# EAGLE schematic DaviShematic (EAGLE 9.6.2)
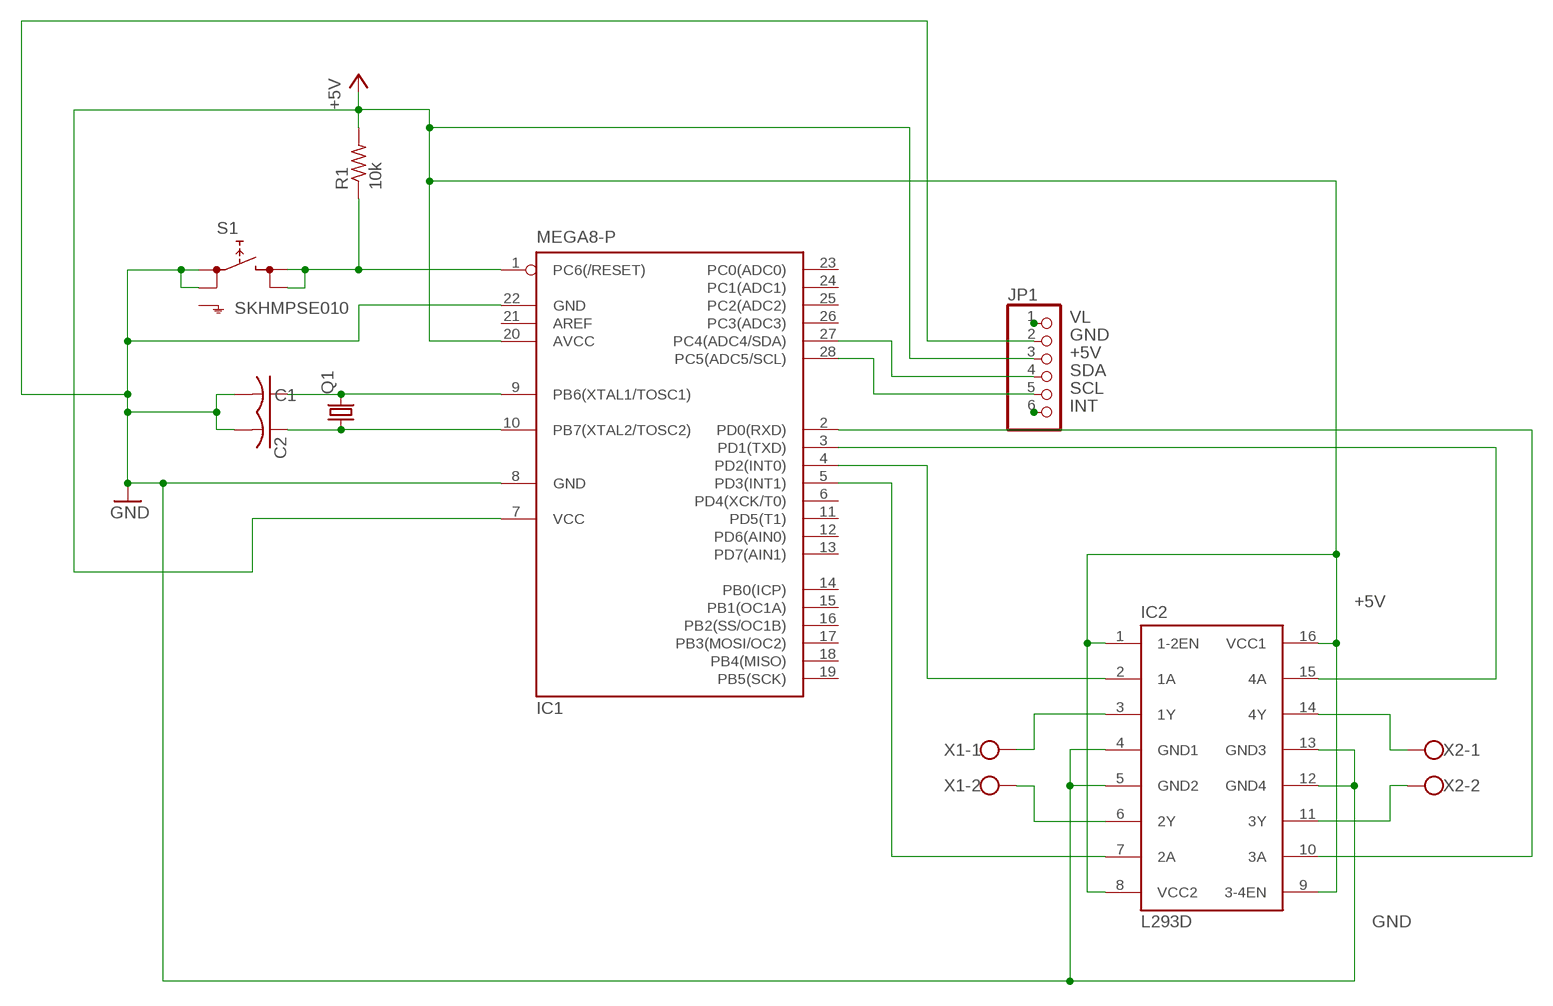
[diagram p0: schematic, sheet 1]

## Parts
C1  C-US025-024X044  [C025-024X044]
C2  C-US025-024X044  [C025-024X044]
IC1  MEGA8-P  [DIL28-3]
IC2  L293D  [DIL16]
JP1  PINHD-1X6  [1X06]
Q1  CRYSTALHC49U-V  [HC49U-V]
R1  10k  R-US_0207/7  [0207/7]
S1  SKHMPSE010  [SKHMPXE010]
X1  W237-102  [W237-102]
X2  W237-102  [W237-102]

## Nets
+5V: IC1.7(VCC) IC1.20(AVCC) IC2.1(1-2EN) IC2.8(VCC2) IC2.9(3-4EN) IC2.16(VCC1) JP1.3 R1.2
GND: C1.2 C2.2 IC1.8(GND) IC1.22(GND) IC2.4(GND1) IC2.5(GND2) IC2.12(GND4) IC2.13(GND3) JP1.2 S1.1(1.1) S1.2(1.2)
INT: JP1.6
N$1: IC1.1(PC6(/RESET)) R1.1 S1.3(2.1) S1.4(2.2)
N$2: C1.1 IC1.9(PB6(XTAL1/TOSC1)) Q1.2
N$3: C2.1 IC1.10(PB7(XTAL2/TOSC2)) Q1.1
N$4: IC2.3(1Y) X1.1
N$5: IC2.6(2Y) X1.2
N$6: IC2.14(4Y) X2.1
N$7: IC2.11(3Y) X2.2
N$8: IC1.4(PD2(INT0)) IC2.2(1A)
N$9: IC1.5(PD3(INT1)) IC2.7(2A)
N$10: IC1.3(PD1(TXD)) IC2.15(4A)
N$11: IC1.2(PD0(RXD)) IC2.10(3A)
SCL: IC1.28(PC5(ADC5/SCL)) JP1.5
SDA: IC1.27(PC4(ADC4/SDA)) JP1.4
VL: JP1.1
Unconnected: IC1.6(PD4(XCK/T0)) IC1.11(PD5(T1)) IC1.12(PD6(AIN0)) IC1.13(PD7(AIN1)) IC1.14(PB0(ICP)) IC1.15(PB1(OC1A)) IC1.16(PB2(SS/OC1B)) IC1.17(PB3(MOSI/OC2)) IC1.18(PB4(MISO)) IC1.19(PB5(SCK)) IC1.21(AREF) IC1.23(PC0(ADC0)) IC1.24(PC1(ADC1)) IC1.25(PC2(ADC2)) IC1.26(PC3(ADC3)) S1.5(SH)

## Library data of the parts
C1 C2 = rcl:C-US: CAPACITOR, American symbol; SPICEPREFIX: C
IC1 = atmel:MEGA8-P: MICROCONTROLLER 8 Kbytes FLASH, 1 kbytes SRAM, 512 bytes EEPROM, USART, 4-channel 10 bit ADC, 2-channel 8 bit ADC Pin compatible with Atmega48, ATMega88, ATMega168 Source: avr.lbr; OC_FARNELL: unknown; OC_NEWARK: unknown
IC2 = st-microelectronics:L293D: PUSH-PULL 4 CHANNEL DRIVER; MPN: L293D; OC_FARNELL: 9589619; OC_NEWARK: 56P8249
JP1 = pinhead:PINHD-1X6: PIN HEADER
Q1 = crystal:CRYSTAL: CRYSTAL; OC_FARNELL: 1666969; OC_NEWARK: unknown
R1 = rcl:R-US_: RESISTOR, American symbol; SPICEPREFIX: R
S1 = switch:SKHMP*E010: 6.2 X 6.5mm TACT Switch (SMD) Source: http://www3.alps.co.jp/WebObjects/catalog.woa/PDF/E/Switch/Tact/SKHM/SKHM.PDF
X1 X2 = con-wago-500:W237-102: WAGO SCREW CLAMP; MPN: 237-102; OC_FARNELL: unknown; OC_NEWARK: 70K9898